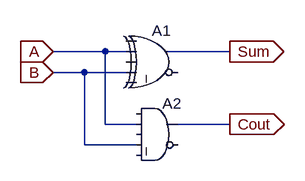
[diagram p0: schematic half-adder.asc]
half-adder.asc, the LTspice schematic file:
Version 4
SHEET 1 880 680
WIRE 112 80 32 80
WIRE 144 80 112 80
WIRE 304 80 208 80
WIRE 80 112 32 112
WIRE 144 112 80 112
WIRE 112 192 112 80
WIRE 160 192 112 192
WIRE 304 192 224 192
WIRE 80 224 80 112
WIRE 160 224 80 224
FLAG 304 80 Sum
IOPIN 304 80 Out
FLAG 304 192 Cout
IOPIN 304 192 Out
FLAG 32 80 A
IOPIN 32 80 In
FLAG 32 112 B
IOPIN 32 112 In
SYMBOL Digital\\xor 192 32 R0
SYMATTR InstName A1
SYMBOL Digital\\and 192 144 R0
SYMATTR InstName A2

The netlist it stands for:
* half-adder.asc
A1 0 A 0 B 0 0 Sum 0 XOR
A2 0 A 0 B 0 0 Cout 0 AND
.backanno
.end